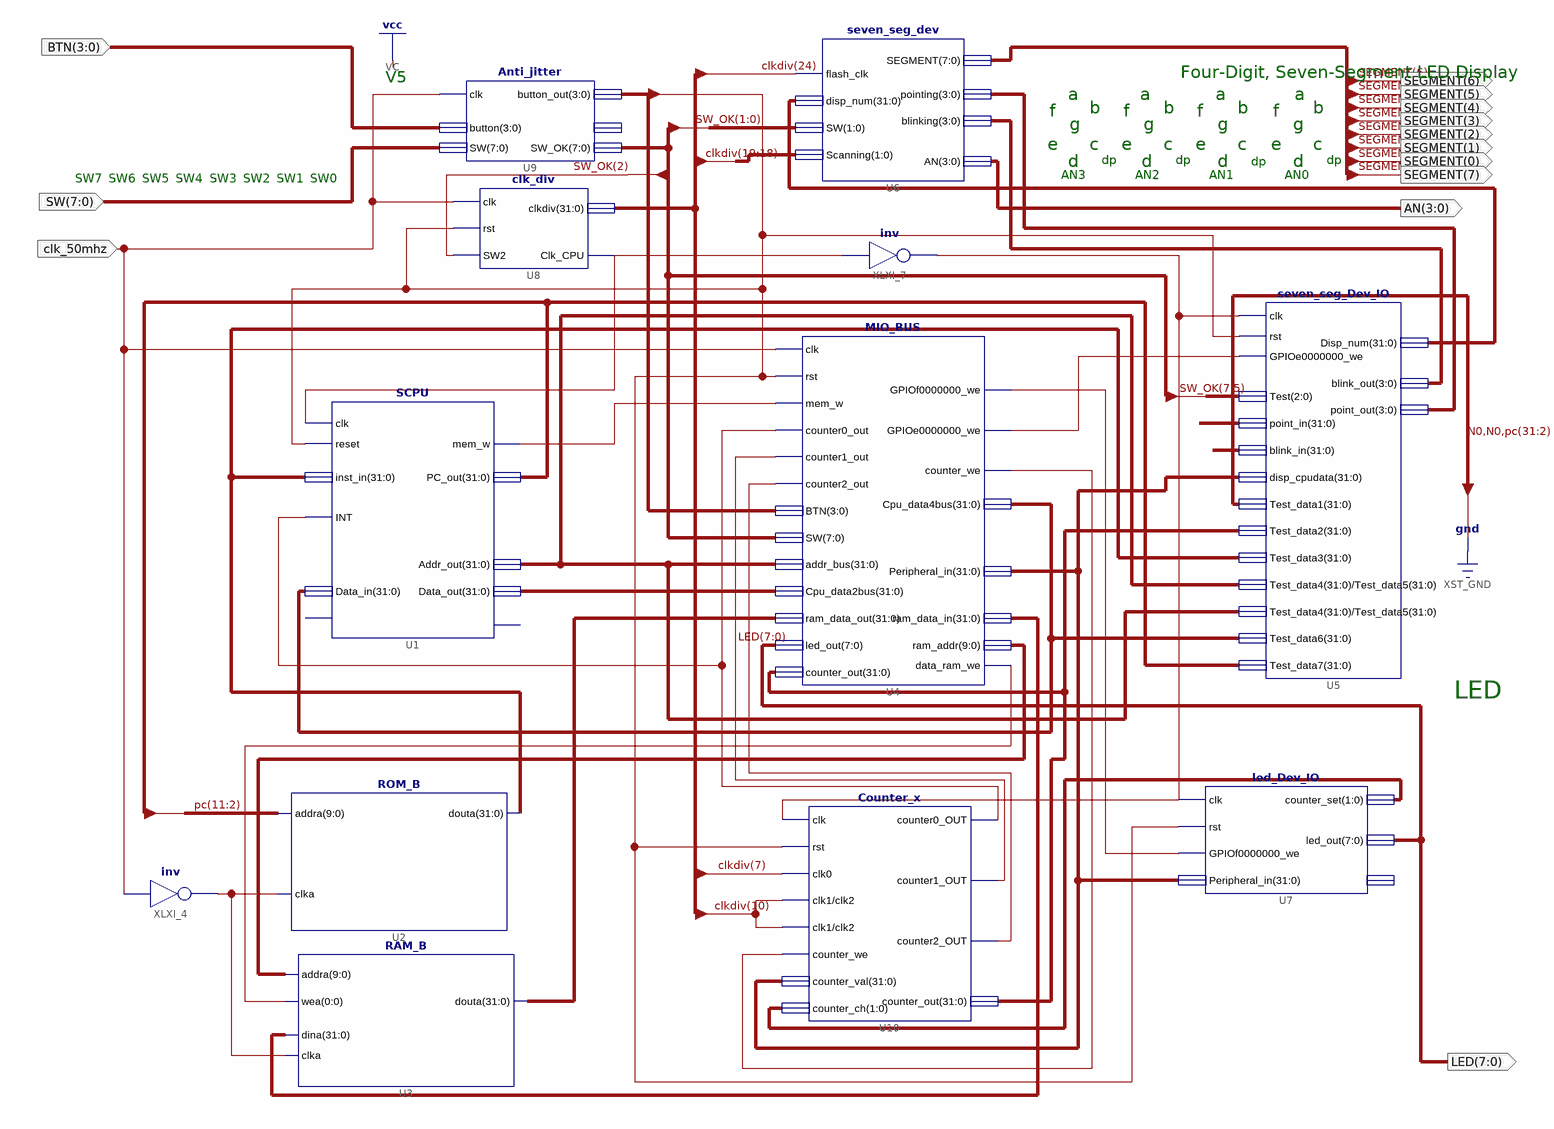
[diagram p0: schematic sheet 1]
// Xilinx ISE schematic orgexp.sch (spartan6) as structural Verilog: 12 symbols, 13 ports
module orgexp (
  input  clk_50mhz,
  input  [3:0] BTN,
  input  [7:0] SW,
  output [7:0] LED,
  output [3:0] AN,
  output [7:0] SEGMENT
);

  wire clka, counter0_out, counter1_out, counter2_out, counter_we, CPU_CLK, GPIOe0000000_we, mem_w, wea,
       XLXN_442, XLXN_485;
  wire [1:0] counter_ch;
  wire [3:0] blink, button_out, XLXN_341, XLXN_357;
  wire [7:0] SW_OK;
  wire [9:0] addra;
  wire [31:0] Addr_out, clkdiv, counter_out, counter_val, Data_in, Data_out, Disp_num, pc, ram_data, ram_din,
       rom_dout;

  seven_seg_Dev_IO U5 (
    .clk(XLXN_442), .Test(SW_OK[7:5]), .point_in({32{1'b1}}), .blink_in({{24{1'b0}}, blink, blink}),
    .disp_cpudata(counter_val), .Test_data1({2'b00, pc[31:2]}), .Test_data2(counter_out),
    .Test_data3(rom_dout), .Test_data4(Addr_out), .Test_data5(Addr_out), .Test_data6(Data_in),
    .Test_data7(pc), .blink_out(XLXN_357), .point_out(XLXN_341), .rst(button_out[3]),
    .GPIOe0000000_we(GPIOe0000000_we), .Disp_num(Disp_num));
  seven_seg_dev U6 (
    .pointing(XLXN_341), .blinking(XLXN_357), .SW(SW_OK[1:0]), .Scanning(clkdiv[19:18]), .disp_num(Disp_num),
    .flash_clk(clkdiv[24]), .SEGMENT(SEGMENT), .AN(AN));
  ROM_B U2 (.addra(pc[11:2]), .clka(clka), .douta(rom_dout));
  RAM_B U3 (.addra(addra), .clka(clka), .wea(wea), .dina(ram_din), .douta(ram_data));
  not XLXI_4 (clka, clk_50mhz);
  Anti_jitter U9 (
    .clk(clk_50mhz), .SW(SW), .button_out(button_out), .SW_OK(SW_OK), .button(BTN));  // open: button_pulse
  clk_div U8 (.clk(clk_50mhz), .rst(button_out[3]), .SW2(SW_OK[2]), .clkdiv(clkdiv), .Clk_CPU(CPU_CLK));
  MIO_BUS U4 (
    .clk(clk_50mhz), .rst(button_out[3]), .mem_w(mem_w), .counter0_out(counter0_out),
    .counter1_out(counter1_out), .counter2_out(counter2_out), .BTN(button_out), .SW(SW_OK),
    .ram_data_out(ram_data), .led_out(LED), .counter_out(counter_out), .GPIOf0000000_we(XLXN_485),
    .GPIOe0000000_we(GPIOe0000000_we), .counter_we(counter_we), .ram_data_in(ram_din), .data_ram_we(wea),
    .ram_addr(addra), .Cpu_data4bus(Data_in), .Peripheral_in(counter_val), .Cpu_data2bus(Data_out),
    .addr_bus(Addr_out));
  SCPU U1 (
    .clk(CPU_CLK), .INT(counter0_out), .inst_in(rom_dout), .reset(button_out[3]), .Data_in(Data_in),
    .mem_w(mem_w), .PC_out(pc), .Addr_out(Addr_out), .Data_out(Data_out));  // open: MIO_ready, CPU_MIO
  not XLXI_7 (XLXN_442, CPU_CLK);
  Counter_x U10 (
    .clk(XLXN_442), .rst(button_out[3]), .clk0(clkdiv[7]), .clk1(clkdiv[10]), .clk2(clkdiv[10]),
    .counter_we(counter_we), .counter_val(counter_val), .counter_ch(counter_ch), .counter0_OUT(counter0_out),
    .counter1_OUT(counter1_out), .counter2_OUT(counter2_out), .counter_out(counter_out));
  led_Dev_IO U7 (
    .clk(XLXN_442), .rst(button_out[3]), .GPIOf0000000_we(XLXN_485), .Peripheral_in(counter_val),
    .counter_set(counter_ch), .led_out(LED));  // open: GPIOf0

  // Notes on the sheet:
  //   Four-Digit, Seven-Segment LED Display
  //   V5
  //   a
  //   a
  //   a
  //   a
  //   b
  //   b
  //   b
  //   b
  //   f
  //   f
  //   f
  //   f
  //   g
  //   g
  //   g
  //   g
  //   e
  //   c
  //   e
  //   c
  //   e
  //   c
  //   e
  //   c
  //   dp
  //   dp
  //   dp
  //   d
  //   d
  //   d
  //   dp
  //   d
  //   AN3
  //   AN2
  //   AN1
  //   AN0
  //   SW7
  //   SW6
  //   SW5
  //   SW4
  //   SW3
  //   SW2
  //   SW1
  //   SW0
  //   LED
endmodule
